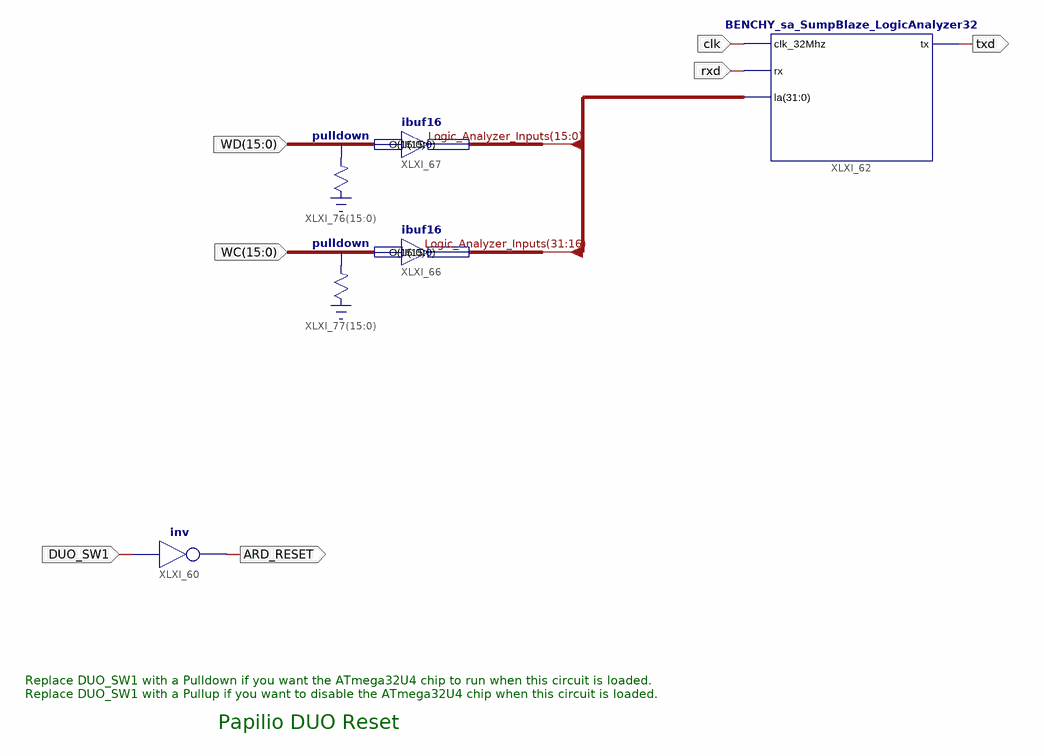
[diagram p0: schematic sheet 1]
// Xilinx ISE schematic Papilio_DUO_LX9.sch (spartan6) as structural Verilog: 6 symbols, 7 ports
module Papilio_DUO_LX9 (
  input  DUO_SW1,
  input  clk,
  input  rxd,
  input  [15:0] WD,
  input  [15:0] WC,
  output ARD_RESET,
  output txd
);

  wire [31:0] Logic_Analyzer_Inputs;

  not XLXI_60 (ARD_RESET, DUO_SW1);
  BENCHY_sa_SumpBlaze_LogicAnalyzer32 #(.brams(32)) XLXI_62 (
    .clk_32Mhz(clk), .la(Logic_Analyzer_Inputs), .rx(rxd), .tx(txd));
  ibuf16 XLXI_67 (.I(WD), .O(Logic_Analyzer_Inputs[15:0]));
  ibuf16 XLXI_66 (.I(WC), .O(Logic_Analyzer_Inputs[31:16]));
  \pulldown  XLXI_76[15:0] (.O(WD));
  \pulldown  XLXI_77[15:0] (.O(WC));

  // Notes on the sheet:
  //   Replace DUO_SW1 with a Pulldown if you want the ATmega32U4 chip to run when this circuit is loaded.
  //   Replace DUO_SW1 with a Pullup if you want to disable the ATmega32U4 chip when this circuit is loaded.
  //   Papilio DUO Reset
endmodule
